# Altium schematic sheet P17 SPI Flash.SchDoc
size 420 x 297 mm
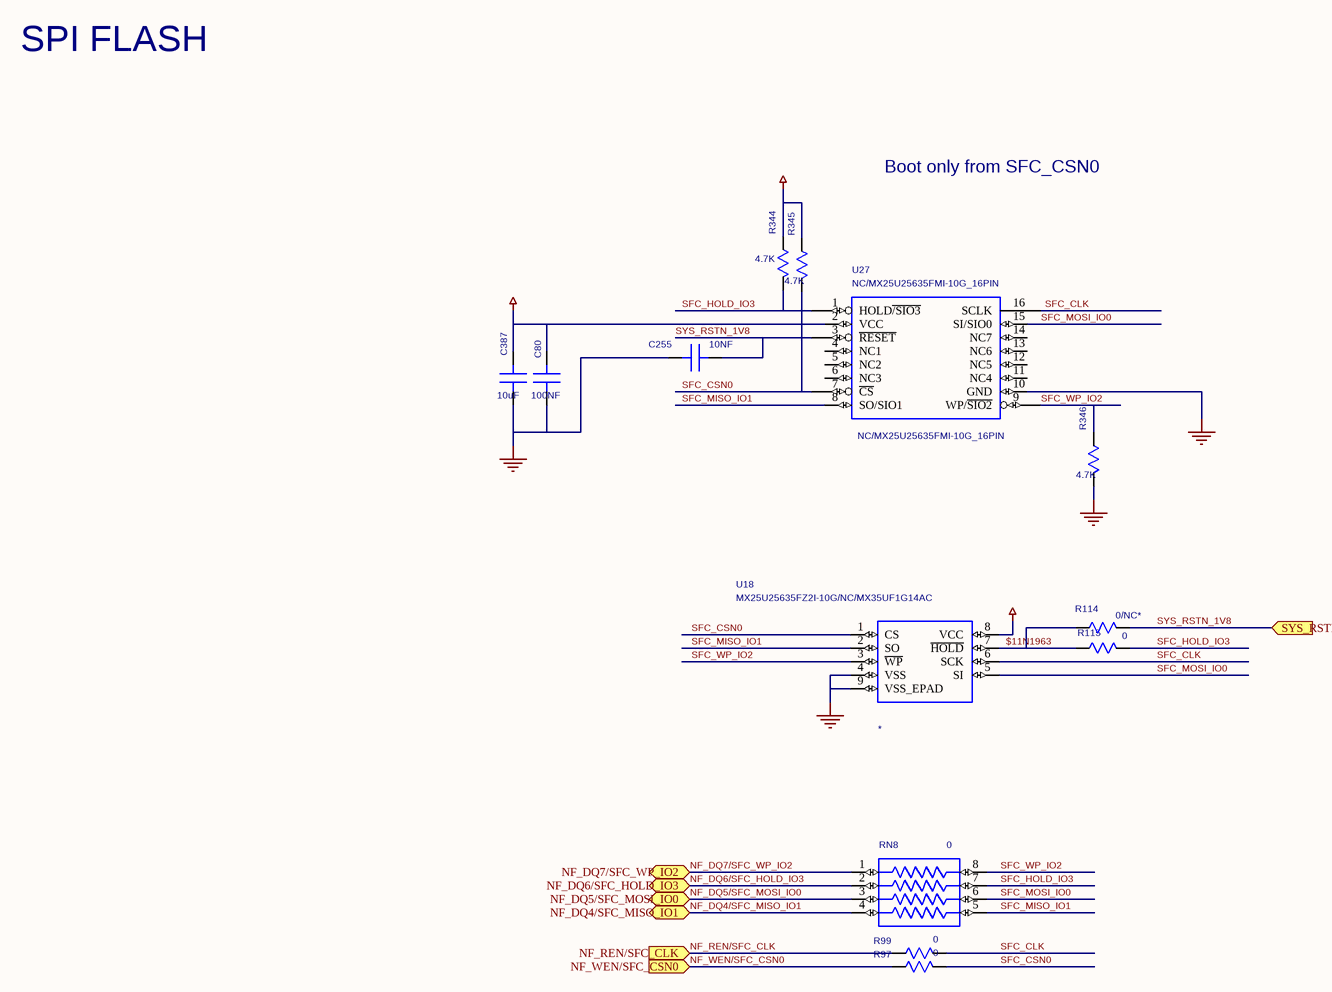
[diagram p0: P17 SPI Flash.SchDoc]

## Parts
C80  100NF  [SC0402]
C255  10NF  [SC0402]
C387  10uF  [SC0603]
R97  0  [SR0402]
R99  0  [SR0402]
R114  0/NC*  [SR0402]
R115  0  [SR0402]
R344  4.7K  [SR0402]
R345  4.7K  [SR0402]
R346  4.7K  [SR0402]
RN8  0  [SRN8-1608]
U18  MX25U25635FZ2I-10G/NC/MX35UF1G14AC  [WSON8-MX25L12835ZN]
U27  NC/MX25U25635FMI-10G_16PIN  [SOP16-50-300A]

## Ports
NF_DQ4/SFC_MISO_IO1, NF_DQ5/SFC_MOSI_IO0, NF_DQ6/SFC_HOLD_IO3, NF_DQ7/SFC_WP_IO2, NF_REN/SFC_CLK, NF_WEN/SFC_CSN0, SYS_RSTN_1V8

## Nets
1V8: C80.1(A) C387.1(A) R344.1(A) R345.1(A) U18.8(VCC) U27.2(VCC)
GND: C80.2(B) C255.1(A) C387.2(B) R346.2(B) U18.4(VSS) U18.9(VSS_EPAD) U27.10(GND)
$11N1963: R114.1(A) R115.1(A) U18.7(~{HOLD})
NF_DQ4/SFC_MISO_IO1: RN8.4 ; port NF_DQ4/SFC_MISO_IO1
NF_DQ5/SFC_MOSI_IO0: RN8.3 ; port NF_DQ5/SFC_MOSI_IO0
NF_DQ6/SFC_HOLD_IO3: RN8.2 ; port NF_DQ6/SFC_HOLD_IO3
NF_DQ7/SFC_WP_IO2: RN8.1 ; port NF_DQ7/SFC_WP_IO2
NF_REN/SFC_CLK: R99.1(A) ; port NF_REN/SFC_CLK
NF_WEN/SFC_CSN0: R97.1(A) ; port NF_WEN/SFC_CSN0
SFC_CLK: R99.2(B) U18.6(SCK) U27.16(SCLK)
SFC_CSN0: R97.2(B) R345.2(B) U18.1(CS) U27.7(~{CS})
SFC_HOLD_IO3: R115.2(B) R344.2(B) RN8.7 U27.1(HOLD~{/SIO3})
SFC_MISO_IO1: RN8.5 U18.2(SO) U27.8(SO/SIO1)
SFC_MOSI_IO0: RN8.6 U18.5(SI) U27.15(SI/SIO0)
SFC_WP_IO2: R346.1(A) RN8.8 U18.3(~{WP}) U27.9(WP/~{SIO2})
SYS_RSTN_1V8: C255.2(B) R114.2(B) U27.3(~{RESET}) ; port SYS_RSTN_1V8

Not connected (* = marked no-connect by the designer): U27 4(NC1) 5(NC2) 6(NC3) 11(NC4) 12(NC5) 13(NC6) 14(NC7)

## Notes on the sheet
- SPI FLASH
- Boot only from SFC_CSN0

## Library data of the parts
C80 = C: PARTS: 1; OriginalSymbolOrigin: (0,0); DEVICE: RMEMK105BJ104KV_FR; LEVEL: STD; PINSWAP: (A,B); %208%%161%%192%%224%%195%%251%%179%%198%: SMD陶瓷电容; %195%%232%%202%%246%: SMD陶瓷电容-16V-100NF-+/-10%-X7R-0402-BT; CODE: 8070614; %182%%238%%182%%168%%185%%164%%215%%247%%181%%231%%209%%185%(V): 16; COMPONENT_HIGH_MAX: 0.55MM; PKG_TYPE: SC0402
C255 = C: PARTS: 1; OriginalSymbolOrigin: (0,0); DEVICE: GRM155R71C103KA01D; LEVEL: STD; PINSWAP: (A,B); %208%%161%%192%%224%%195%%251%%179%%198%: SMD陶瓷电容; %195%%232%%202%%246%: SMD陶瓷电容-16V-10NF-+/-10%-X7R-0402-BT,TS16949; CODE: 8070449; %182%%238%%182%%168%%185%%164%%215%%247%%181%%231%%209%%185%(V): 16; COMPONENT_HIGH_MAX: 0.56MM; PKG_TYPE: SC0402
C387 = C: PARTS: 1; OriginalSymbolOrigin: (0,0); DEVICE: C1608X7S0J106MT000E; LEVEL: STD; PINSWAP: (A,B); %208%%161%%192%%224%%195%%251%%179%%198%: SMD陶瓷电容; %195%%232%%202%%246%: SMD陶瓷电容-6.3V-10000nF-+/-20%-X7T-0603; CODE: 8071624; %182%%238%%182%%168%%185%%164%%215%%247%%181%%231%%209%%185%(V): 6.3; COMPONENT_HIGH_MAX: 1mm; PKG_TYPE: SC0603
R97 R99 = R_Dup1: PARTS: 1; OriginalSymbolOrigin: (0,0); PINSWAP: (A,B); DEVICE: RC0402JR_070R; LEVEL: STD; %208%%161%%192%%224%%195%%251%%179%%198%: 片式厚膜电阻器; %195%%232%%202%%246%: 片式厚膜电阻器-0.0625W-0ohm-< 50mohm-0402-1A-BT; CODE: 7090800; COMPONENT_HIGH_MAX: 0.4MM; PKG_TYPE: SR0402
R114 = R_Dup1: PARTS: 1; OriginalSymbolOrigin: (0,0); PINSWAP: (A,B); DEVICE: RC0402JR_070R; LEVEL: STD; %208%%161%%192%%224%%195%%251%%179%%198%: 片式厚膜电阻器; %195%%232%%202%%246%: 片式厚膜电阻器-0.0625W-0OHM-< 50MOHM-0402-1A-BT; CODE: 7090800; %182%%238%%182%%168%%185%%166%%194%%202%(W): 0.06; %215%%232%%214%%181%%212%%202%%208%%237%%198%%171%%178%%238%: < 50MOHM; COMPONENT_HIGH_MAX: 0.4MM; VARIANT_ID: $11I1970; PKG_TYPE: SR0402
R115 = R_Dup1: PARTS: 1; OriginalSymbolOrigin: (0,0); PINSWAP: (A,B); DEVICE: RC0402JR_070R; LEVEL: STD; %182%%238%%182%%168%%185%%166%%194%%202%(W): 0.06; %215%%232%%214%%181%%212%%202%%208%%237%%198%%171%%178%%238%: < 50MOHM; COMPONENT_HIGH_MAX: 0.4MM; CODE: 7090800; %195%%232%%202%%246%: 片式厚膜电阻器-0.0625W-0OHM-< 50MOHM-0402-1A-BT; %208%%161%%192%%224%%195%%251%%179%%198%: 片式厚膜电阻器; PKG_TYPE: SR0402
R344 R345 = R_Dup1: PARTS: 1; OriginalSymbolOrigin: (0,0); PINSWAP: (A,B); DEVICE: RK73B1ELTP472J; LEVEL: STD; CODE: 7090793; %195%%232%%202%%246%: 片式厚膜电阻器-0.0625W-4700ohm-+/-5%-0402-BT; %182%%238%%182%%168%%185%%166%%194%%202%(W): 0.06; %215%%232%%214%%181%%212%%202%%208%%237%%198%%171%%178%%238%: +/-5%; COMPONENT_HIGH_MAX: 0.4MM; %208%%161%%192%%224%%195%%251%%179%%198%: 片式厚膜电阻器; PKG_TYPE: SR0402
R346 = R_Dup1: PARTS: 1; OriginalSymbolOrigin: (0,0); PINSWAP: (A,B); DEVICE: RK73B1ELTP472J; LEVEL: STD; %208%%161%%192%%224%%195%%251%%179%%198%: 片式厚膜电阻器; COMPONENT_HIGH_MAX: 0.4MM; %215%%232%%214%%181%%212%%202%%208%%237%%198%%171%%178%%238%: +/-5%; %182%%238%%182%%168%%185%%166%%194%%202%(W): 0.06; %195%%232%%202%%246%: 片式厚膜电阻器-0.0625W-4700ohm-+/-5%-0402-BT; CODE: 7090793; PKG_TYPE: SR0402
RN8 = RND8-4: PARTS: 1; OriginalSymbolOrigin: (0,0); CODE: 7080126; LEVEL: STD; DEVICE: CNZ1J4KTTD; COMPONENT_HIGH_MAX: 0.7MM; %195%%232%%202%%246%: 电阻网络-0.0625W-0ohm-4个-8PIN-+/-5%-SMT-独立式-3.2*1.6*0.5-0.8; %208%%161%%192%%224%%195%%251%%179%%198%: 电阻网络; PKG_TYPE: SRN8-1608
U18 = SPI_NAND_FLASH_0: PARTS: 1; OriginalSymbolOrigin: (0,0); LEVEL: STD; CODE: HBVT3173; PKG_TYPE: *; DEVICE: MX35UF1G14AC
U27 = MX25L25635EMI-12G_1: PARTS: 1; OriginalSymbolOrigin: (0,0); LEVEL: STD; VARIANT_ID: $11I508; CODE: HBVT3125; DEVICE: NC/MX25U25635FMI-10G_16PIN; PKG_TYPE: SOP16-50-300A